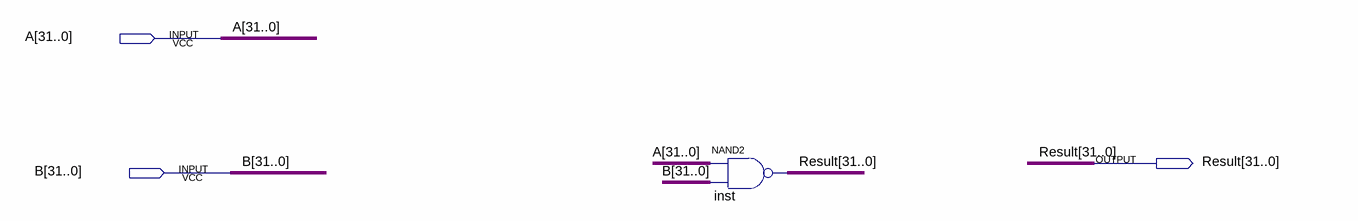
[diagram p0: schematic sheet]
// Quartus schematic Nand_32bit.bdf as structural Verilog: 1 symbols, 3 pins
module Nand_32bit (
  input  [31:0] A,
  input  [31:0] B,
  output [31:0] Result
);

  assign Result = ~(A & B);  // NAND2 inst, 32 bits wide
endmodule
